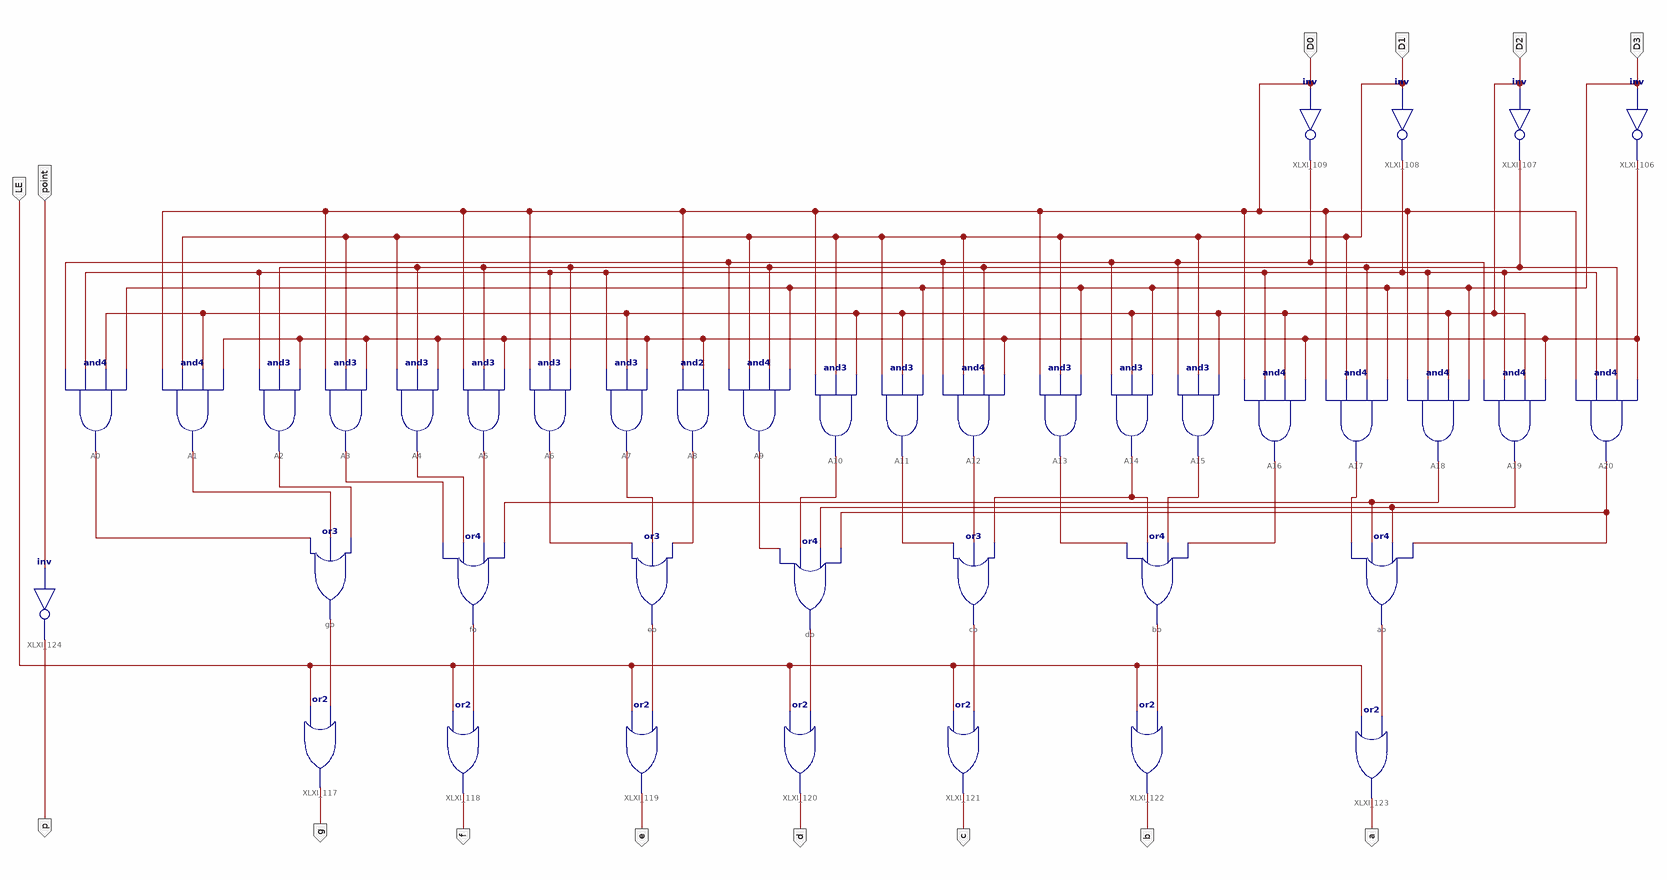
[diagram p0: schematic sheet 1]
// Xilinx ISE schematic MC14495_ZJU.sch (kintex7) as structural Verilog: 40 symbols, 14 ports
module MC14495_ZJU (
  input  D0,
  input  D1,
  input  D2,
  input  D3,
  input  LE,
  input  point,
  output a,
  output b,
  output c,
  output d,
  output e,
  output f,
  output g,
  output p
);

  wire XLXN_5, XLXN_6, XLXN_7, XLXN_8, XLXN_10, XLXN_11, XLXN_12, XLXN_13, XLXN_14, XLXN_15, XLXN_16,
       XLXN_17, XLXN_18, XLXN_19, XLXN_20, XLXN_21, XLXN_22, XLXN_23, XLXN_24, XLXN_25, XLXN_26, XLXN_27,
       XLXN_28, XLXN_29, XLXN_30, XLXN_31, XLXN_32, XLXN_33, XLXN_34, XLXN_35, XLXN_43, XLXN_44;

  and A0 (XLXN_10, XLXN_8, XLXN_7, D2, D3);
  and A1 (XLXN_11, D0, D1, D2, XLXN_5);
  and A2 (XLXN_12, XLXN_7, XLXN_6, XLXN_5);
  and A3 (XLXN_13, D0, D1, XLXN_5);
  and A4 (XLXN_14, D1, XLXN_6, XLXN_5);
  and A5 (XLXN_15, D0, XLXN_6, XLXN_5);
  and A6 (XLXN_29, D0, XLXN_7, XLXN_6);
  and A7 (XLXN_28, XLXN_7, D2, XLXN_5);
  and A8 (XLXN_27, D0, XLXN_5);
  and A9 (XLXN_26, XLXN_8, D1, XLXN_6, D3);
  and A10 (XLXN_25, D0, D1, D2);
  and A11 (XLXN_24, D1, D2, D3);
  and A12 (XLXN_23, XLXN_8, D1, XLXN_6, XLXN_5);
  and A13 (XLXN_30, D0, D1, D3);
  and A14 (XLXN_22, XLXN_8, D2, D3);
  and A15 (XLXN_21, XLXN_8, D1, D2);
  and A16 (XLXN_20, D0, XLXN_7, D2, XLXN_5);
  and A17 (XLXN_19, D0, D1, XLXN_6, D3);
  and A18 (XLXN_16, D0, XLXN_7, D2, D3);
  and A19 (XLXN_18, XLXN_8, XLXN_7, D2, XLXN_5);
  and A20 (XLXN_17, D0, XLXN_7, XLXN_6, XLXN_5);
  not XLXI_106 (XLXN_5, D3);
  not XLXI_107 (XLXN_6, D2);
  not XLXI_108 (XLXN_7, D1);
  not XLXI_109 (XLXN_8, D0);
  or go (XLXN_44, XLXN_10, XLXN_11, XLXN_12);
  or eo (XLXN_31, XLXN_29, XLXN_28, XLXN_27);
  or co (XLXN_33, XLXN_24, XLXN_23, XLXN_22);
  or fo (XLXN_43, XLXN_13, XLXN_14, XLXN_15, XLXN_16);
  or \do  (XLXN_32, XLXN_26, XLXN_25, XLXN_18, XLXN_17);
  or bo (XLXN_34, XLXN_30, XLXN_22, XLXN_21, XLXN_20);
  or ao (XLXN_35, XLXN_19, XLXN_16, XLXN_18, XLXN_17);
  or XLXI_117 (g, LE, XLXN_44);
  or XLXI_118 (f, LE, XLXN_43);
  or XLXI_119 (e, LE, XLXN_31);
  or XLXI_120 (d, LE, XLXN_32);
  or XLXI_121 (c, LE, XLXN_33);
  or XLXI_122 (b, LE, XLXN_34);
  or XLXI_123 (a, LE, XLXN_35);
  not XLXI_124 (p, point);
endmodule
